# Altium project PCB_Project_sch_layout.PrjPcb (part 2 of 2)

## Sheet Project_Node_Sensors.SchDoc: Principal Node_Sensor Schematic
size A; Date: 10/08/2024; Author: Prudhvi Kondapalli; CompanyName: CU Boulder; DrawnBy: Project_Vega_Team; Engineer: Prudhvi Kondapalli; DocumentNumber: 1; Revision: 1; SheetNumber: 5; SheetTotal: 7
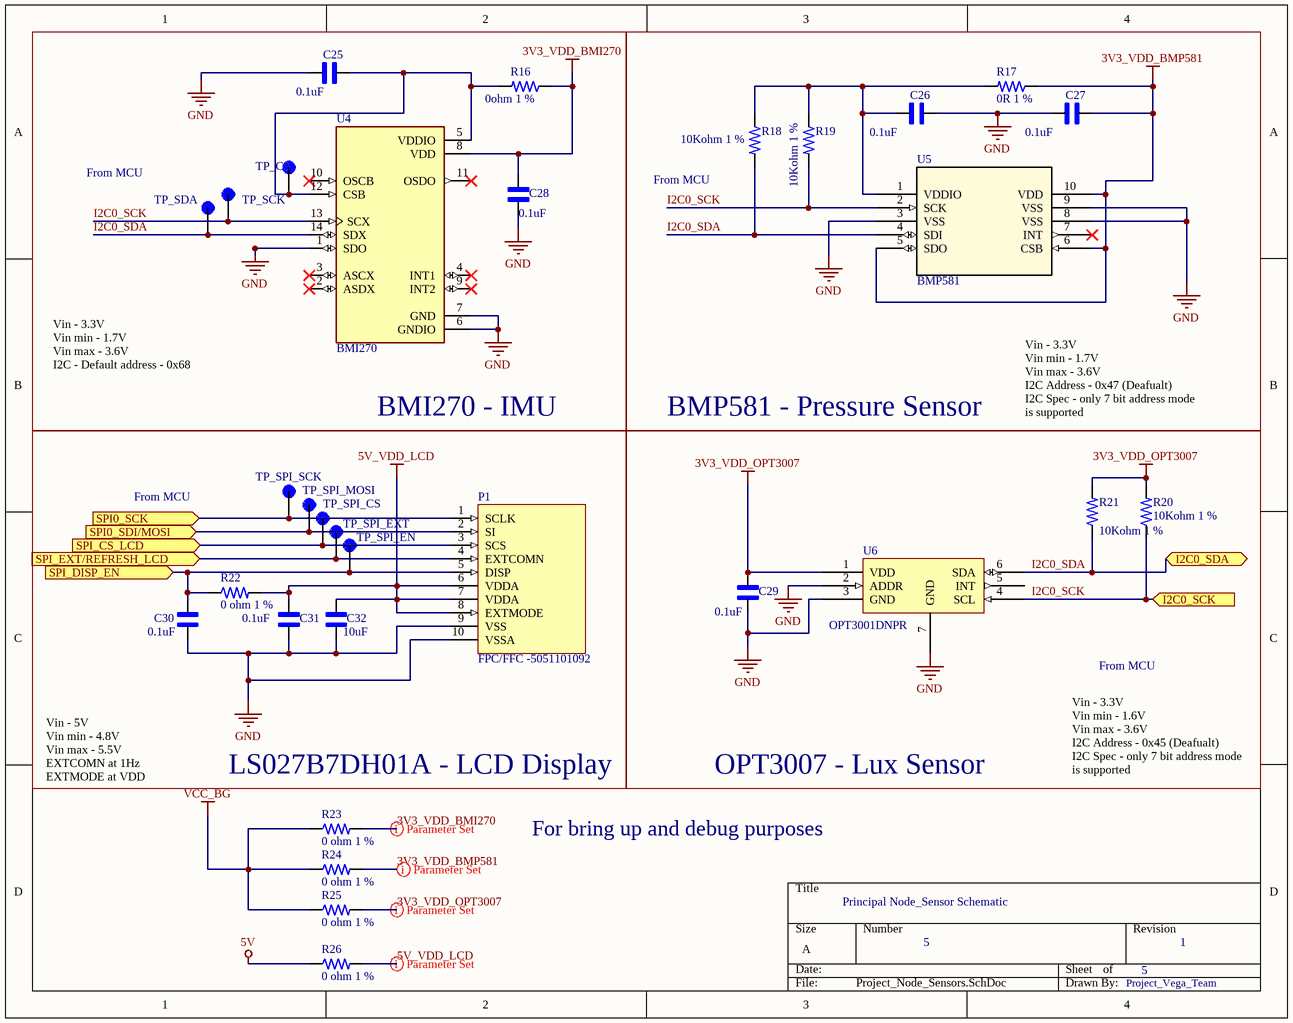
[diagram p4: Project_Node_Sensors.SchDoc]

### Parts
C25  0.1uF  [CAPC1608X90]
C26  0.1uF  [CAPC1608X90]
C27  0.1uF  [CAPC1608X90]
C28  0.1uF  [CAPC1608X90]
C29  0.1uF  [CAPC1608X90]
C30  0.1uF  [CAPC1608X90]
C31  0.1uF  [CAPC1608X90]
C32  10uF  [CAPC1608X90]
P1  FPC/FFC -5051101092  [CON_5051101092_MOL]
R16  0ohm 1 %  [RES_0603_1608X06]
R17  0R 1 %  [RES_0603_1608X06]
R18  10Kohm 1 %  [RES_0603_1608X06]
R19  10Kohm 1 %  [RES_0603_1608X06]
R20  10Kohm 1 %  [RES_0603_1608X06]
R21  10Kohm 1 %  [RES_0603_1608X06]
R22  0 ohm 1 %  [RES_0603_1608X06]
R23  0 ohm 1 %  [RES_0603_1608X06]
R24  0 ohm 1 %  [RES_0603_1608X06]
R25  0 ohm 1 %  [RES_0603_1608X06]
R26  0 ohm 1 %  [RES_0603_1608X06]
TP_CS  Test_point  [1]  (value not drawn)
TP_SCK  Test_point  [1]  (value not drawn)
TP_SDA  Test_point  [1]  (value not drawn)
TP_SPI_CS  Test_point  [1]  (value not drawn)
TP_SPI_EN  Test_point  [1]  (value not drawn)
TP_SPI_EXT  Test_point  [1]  (value not drawn)
TP_SPI_MOSI  Test_point  [1]  (value not drawn)
TP_SPI_SCK  Test_point  [1]  (value not drawn)
U4  BMI270  [XDCR_BMI270]
U5  BMP581  [QFN10_BMP581_BOS-M]
U6  OPT3001DNPR  [OPT3001-SON127P600-8N]

### Blocks framed on the sheet
BMI270 - IMU: C25 C28 R16 TP_CS TP_SCK TP_SDA U4
BMP581 - Pressure Sensor: C26 C27 R17-R19 U5

### Ports
I2C0_SCK (in, see Principal_Node[2C]), I2C0_SDA (bidir, see Principal_Node[2C]), SPI0_SCK (in, see Principal_Node[2D]), SPI0_SDI/MOSI (in, see Principal_Node[2D]), SPI_CS_LCD (in, see Principal_Node[2D]), SPI_DISP_EN (in, see Principal_Node[2C]), SPI_EXT/REFRESH_LCD (in, see Principal_Node[2C])

### Nets
3V3_VDD_BMI270: C28.1 R16.1 R23.2 U4.8(VDD)
3V3_VDD_BMP581: C27.2 R17.1 R24.2 U5.5(SDO) U5.6(CSB) U5.10(VDD)
3V3_VDD_OPT3007: C29.2 R20.2 R21.2 R25.2 U6.1(VDD)
5V: R26.1
5V_VDD_LCD: C31.2 C32.2 P1.6(VDDA) P1.7(VDDA) P1.8(EXTMODE) R22.2 R26.2
GND: C25.1 C26.2 C27.1 C28.2 C29.1 C30.1 C31.1 C32.1 P1.9(VSS) P1.10(VSSA) U4.1(SDO) U4.6(GNDIO) U4.7(GND) U5.3(VSS) U5.8(VSS) U5.9(VSS) U6.2(ADDR) U6.3(GND) U6.7(GND)
VCC_BG: R23.1 R24.1 R25.1
I2C0_SCK: R19.2 R20.1 TP_SCK.TP(I2C_SCK) U4.13(SCX) U5.2(SCK) U6.4(SCL) ; port I2C0_SCK
I2C0_SDA: R18.2 R21.1 TP_SDA.TP(I2C_SDA) U4.14(SDX) U5.4(SDI) U6.6(SDA) ; port I2C0_SDA
NetC25_2: C25.2 R16.2 TP_CS.TP(CS) U4.5(VDDIO) U4.12(CSB)
NetC26_1: C26.1 R17.2 R18.1 R19.1 U5.1(VDDIO)
NetC30_2: C30.2 P1.5(DISP) R22.1 TP_SPI_EN.TP(SPI_EN) ; port SPI_DISP_EN
NetP1_1: P1.1(SCLK) TP_SPI_SCK.TP(SPI_SCK) ; port SPI0_SCK
NetP1_2: P1.2(SI) TP_SPI_MOSI.TP(SPI_MOSI) ; port SPI0_SDI/MOSI
NetP1_3: P1.3(SCS) TP_SPI_CS.TP(SPI_CS) ; port SPI_CS_LCD
NetP1_4: P1.4(EXTCOMN) TP_SPI_EXT.TP(SPI_EXT) ; port SPI_EXT/REFRESH_LCD

Not connected (* = marked no-connect by the designer): U4 2(ASDX)* 3(ASCX)* 4(INT1)* 9(INT2)* 10(OSCB)* 11(OSDO)*; U5 7(INT)*; U6 5(INT)

### Layout directives
rule Width Constraint [Pref Width = 10mil    Min Width = 10mil    Max Width = 10mil]: 3V3_VDD_BMI270, 3V3_VDD_BMP581, 3V3_VDD_OPT3007
rule Width Constraint [Pref Width = 20mil    Min Width = 10mil    Max Width = 20mil]: 5V_VDD_LCD

### Notes on the sheet
- From MCU
- Vin - 3.3V
  Vin min - 1.7V
  Vin max - 3.6V
  I2C - Default address - 0x68
- Vin - 3.3V
  Vin min - 1.7V
  Vin max - 3.6V
  I2C Address - 0x47 (Deafualt)
  I2C Spec - only 7 bit address mode is supported
- Vin - 5V
  Vin min - 4.8V
  Vin max - 5.5V
  EXTCOMN at 1Hz
  EXTMODE at VDD
- (near R23) LS027B7DH01A - LCD Display
- OPT3007 - Lux Sensor
- Vin - 3.3V
  Vin min - 1.6V
  Vin max - 3.6V
  I2C Address - 0x45 (Deafualt)
  I2C Spec - only 7 bit address mode is supported
- For bring up and debug purposes

### Library data of the parts
C25-C32 = CC0603KRX7R9BB104: 0.1 ÂµF Â±10% 50V Ceramic Capacitor X7R 0603 (1608 Metric); MF: Yageo; SnapEDA_Link: https://www.snapeda.com/parts/CC0603KRX7R9BB104/Yageo/view-part/?ref=snap; Package: 0603 Yageo; Value: *; MP: CC0603KRX7R9BB104; Check_prices: https://www.snapeda.com/parts/CC0603KRX7R9BB104/Yageo/view-part/?ref=eda
P1 = 5051101092: Easy-On FFC/FPC Connector, 0.50mm Pitch, FD19 Series, Right-Angle, Bottom Contact, 1.90mm Height, 10 Circuits, Gold over Nickel Plating; Manufacturer: Molex; Manufacturer Part Number: 505110-1092; Actuator Material: Nylon,Glass,Polyamide; Actuator Color: Black; Number of Positions: 10; Voltage Rating: 50V; Gender: Receptacle; Mating Cycles: 25; Supplier: Digikey; Supplier Part Number: WM12366CT-ND; RoHS: Yes; Category: FFC / FPC; Stock: 64732; Pricing: 1=0.73, 10=0.545, 25=0.4884, 50=0.4514, 100=0.4185, 250=0.3808, 500=0.35616, 1000=0.33441, 3000=0.3051, 6000=0.28943, 9000=0.28114, 15000=0.27155, 21000=0.26571, 30000=0.26151 (USD); Mounting Technology: Surface Mount; Pins: 10; Contact Material: Bronze; Contact Plating: Gold; Housing Material: Polymer; Housing Color: Beige; Plating: Gold; Min Operating Temperature: -40°C; Max Operating Temperature: 105°C; Packaging: Cut Tape; Termination: Solder; Number of Rows: 1; Series: Easy-On FD19 505110; Number of Circuits: 10; Number of Contacts: 10; Orientation: Right Angle; Height: 4.15mm; Flammability Rating: UL94 V-0; RoHS Compliant: Yes; Reach SVHC Compliant: Unknown; ComponentLink1URL: http://www.farnell.com/datasheets/2215713.pdf?src-supplier=Farnell; ComponentLink1Description: http://www.farnell.com/datasheets/2215713.pdf?src-supplier=Farnell; ComponentLink2URL: https://media.digikey.com/pdf/Data%20Sheets/Molex%20PDFs/FFC-FPC_Connectors.pdf?src-supplier=Digikey; ComponentLink2Description: https://media.digikey.com/pdf/Data%20Sheets/Molex%20PDFs/FFC-FPC_Connectors.pdf?src-supplier=Digikey; ComponentLink3URL: https://www.mouser.com/ds/2/276/5051101092_FFC_FPC_CONNECTORS-772849.pdf?src-supplier=Mouser; ComponentLink3Description: https://www.mouser.com/ds/2/276/5051101092_FFC_FPC_CONNECTORS-772849.pdf?src-supplier=Mouser; ComponentLink4URL: http://www.alliedelec.com/m/d/498d8ef60ec1840486550b3bb04c7a47.pdf?src-supplier=Allied+Electronics; ComponentLink4Description: http://www.alliedelec.com/m/d/498d8ef60ec1840486550b3bb04c7a47.pdf?src-supplier=Allied+Electronics; ComponentLink5URL: https://www.molex.com/datasheets/rohspdf/5051101092_rohs.pdf?src-supplier=Digikey; ComponentLink5Description: https://www.molex.com/datasheets/rohspdf/5051101092_rohs.pdf?src-supplier=Digikey; ComponentLink6URL: https://datasheet.octopart.com/505110-1092-Molex-datasheet-62088043.pdf?src-supplier=Farnell; ComponentLink6Description: https://datasheet.octopart.com/505110-1092-Molex-datasheet-62088043.pdf?src-supplier=Farnell; ComponentLink7URL: http://www.farnell.com/datasheets/2014276.pdf?src-supplier=Element14; ComponentLink7Description: http://www.farnell.com/datasheets/2014276.pdf?src-supplier=Element14; ComponentLink8URL: http://www.farnell.com/datasheets/2215713.pdf?src-supplier=Element14; ComponentLink8Description: http://www.farnell.com/datasheets/2215713.pdf?src-supplier=Element14; ComponentLink9URL: https://datasheet.octopart.com/505110-1092-Molex-datasheet-77521069.pdf?src-supplier=Element14; ComponentLink9Description: https://datasheet.octopart.com/505110-1092-Molex-datasheet-77521069.pdf?src-supplier=Element14; ComponentLink10URL: http://www.farnell.com/datasheets/2215713.pdf?src-supplier=Newark; ComponentLink10Description: http://www.farnell.com/datasheets/2215713.pdf?src-supplier=Newark
R16-R26 = RC0603FR-07140RL: SMD Chip Resistor, 140 Ohm, ± 1%, 100 mW, 0603 [1608 Metric], Thick Film, General Purpose; Manufacturer: Yageo; Value: 140R; Power Rating: 100mW; Voltage Rating: 50V; Temperature Coefficient: 100ppm/°C; Supplier: Digikey; Supplier Part Number: 311-140HRCT-ND; Manufacturer Part Number: RC0603FR-07140RL; RoHS: Yes; Category: Chip SMD Resistors; Stock: 238807; Pricing: 1=0.1, 10=0.019, 50=0.0112, 100=0.0093, 500=0.00622, 1000=0.00532, 5000=0.00382, 10000=0.00335, 25000=0.00287, 35000=0.00278, 50000=0.00257, 125000=0.00232 (USD); Mounting Technology: Surface Mount; Case/Package: 0603; Case Code (Imperial): 0603; Case Code (Metric): 1608; Min Operating Temperature: -55°C; Max Operating Temperature: 155°C; Tolerance: 1%; Packaging: Tape and Reel; Termination: SMD/SMT; Voltage Rating (DC): 50V; Features: Moisture Resistant; Series: RC; Max Power Dissipation: 100mW; Number of Terminations: 2; Construction: Rectangular; Technology: THICK FILM; Length: 1.6mm; Height: 0.45mm; Depth: 0.8mm; Lead Free: Lead Free; RoHS Compliant: Yes; Military Standard: Not; ComponentLink1URL: https://datasheet.ciiva.com/11808/0900766b80c66297-11808828.pdf?src-supplier=Rs; ComponentLink1Description: https://datasheet.ciiva.com/11808/0900766b80c66297-11808828.pdf?src-supplier=Rs; ComponentLink2URL: https://datasheet.ciiva.com/15189/getdatasheetpartid-329205-15189606.pdf?src-supplier=Verical; ComponentLink2Description: https://datasheet.ciiva.com/15189/getdatasheetpartid-329205-15189606.pdf?src-supplier=Verical
TP_CS TP_SCK TP_SDA TP_SPI_CS TP_SPI_EN TP_SPI_EXT TP_SPI_MOSI TP_SPI_SCK = Test_point: SMT Test Point- Mininature-1000 pc Reels; MP: 5019; MF: Keystone Electronics; Value: *; Availability: In Stock; Purchase-URL: https://pricing.snapeda.com/search/part/5019/?ref=eda; Package: None; Price: None
U4 = BMI270: Accelerometer, Gyroscope, 6 Axis Sensor IÂ²C, SPI Output; MF: Bosch Sensortec; Digi-Key_Part_Number: 828-1091-2-ND; Check_prices: https://www.snapeda.com/parts/BMI270/Bosch+Sensortec/view-part/?ref=eda; MP: BMI270; Package: LGA-14 Bosch Sensortec; SnapEDA_Link: https://www.snapeda.com/parts/BMI270/Bosch+Sensortec/view-part/?ref=snap; Value: *; Purchase-URL: https://pricing.snapeda.com/search/part/BMI270/?ref=eda; Supplier 1: Digikey; Supplier Part Number 1: 828-1091-1-ND
U5 = BMP581: No Description Available; Mfr_Name: Bosch Sensortec; RefDes: RefDes; Type: Type
U6 = OPT3001DNPR: Digital ambient light sensor (ALS) with high-precision human-eye response 6-USON -40 to 85; Manufacturer: Texas Instruments; Interface: I2C; Wavelength: 550nm; Min Supply Voltage: 1.6V; Max Supply Voltage: 3.6V; Clock Frequency: 2.6MHz; Output Type: I2C,Digital; Sensing Method: Optical; Supplier: Digikey; Supplier Part Number: 296-40474-1-ND; Manufacturer Part Number: OPT3001DNPR; RoHS: Yes; Category: Integrated Circuits (ICs); Stock: 51147; Pricing: 1=2.99, 5=2.52, 10=2.342, 25=2.1248, 50=1.9744, 100=1.8347, 500=1.54766, 1000=1.43839 (USD); Mounting Technology: Surface Mount; Pins: 6; Min Operating Temperature: -40°C; Max Operating Temperature: 85°C; Packaging: Tape and Reel; Series: -; Reach SVHC Compliant: No; Lead Free: Lead Free; RoHS Compliant: Yes; ComponentLink1URL: http://www.ti.com/lit/ds/symlink/opt3001.pdf?src-supplier=Digikey; ComponentLink1Description: http://www.ti.com/lit/ds/symlink/opt3001.pdf?src-supplier=Digikey; ComponentLink2URL: http://www.ti.com/general/docs/lit/getliterature.tsp?genericPartNumber=OPT3001&amp;&amp;fileType=pdf&src-supplier=Farnell; ComponentLink2Description: http://www.ti.com/general/docs/lit/getliterature.tsp?genericPartNumber=OPT3001&amp;&amp;fileType=pdf&src-supplier=Farnell; ComponentLink3URL: http://www.ti.com/general/docs/lit/getliterature.tsp?genericPartNumber=OPT3001&&fileType=pdf&src-supplier=Avnet; ComponentLink3Description: http://www.ti.com/general/docs/lit/getliterature.tsp?genericPartNumber=OPT3001&&fileType=pdf&src-supplier=Avnet; ComponentLink4URL: http://www.ti.com/general/docs/lit/getliterature.tsp?genericPartNumber=OPT3001&&fileType=pdf&src-supplier=Element14; ComponentLink4Description: http://www.ti.com/general/docs/lit/getliterature.tsp?genericPartNumber=OPT3001&&fileType=pdf&src-supplier=Element14

## Sheet Client_Node_Block_Diagram.SchDoc: Project_Vega_Client_Node_Block_Diagram
size A4; DrawnBy: Project_Vega_Team; Revision: 1; SheetNumber: 6; SheetTotal: 8
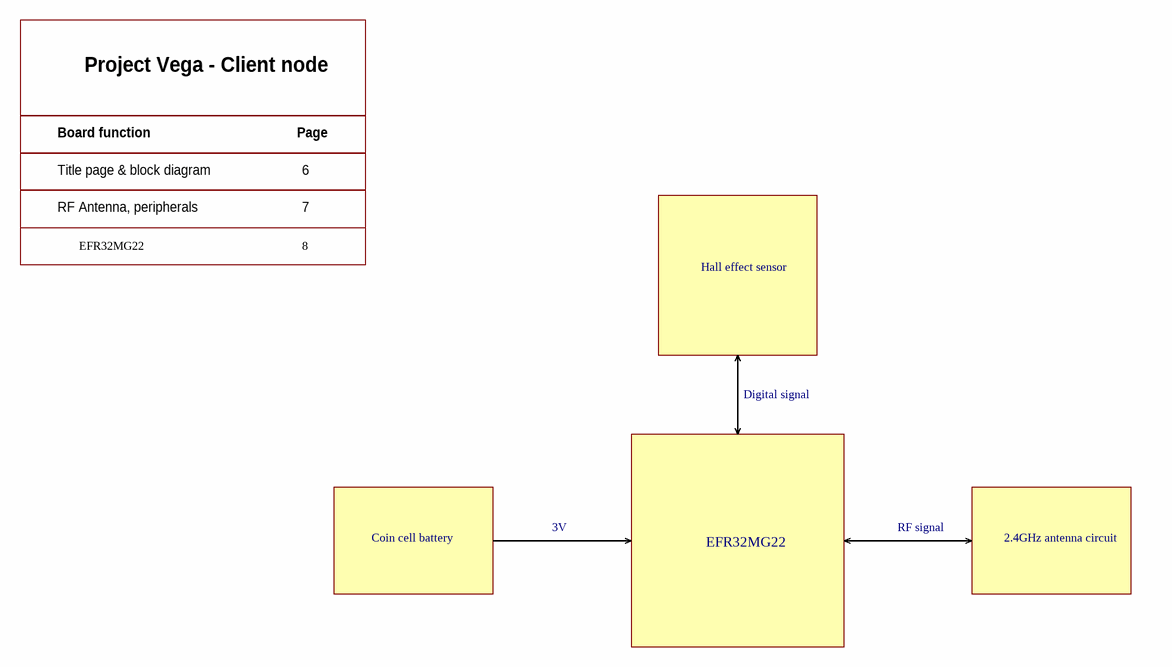
[diagram p5: Client_Node_Block_Diagram.SchDoc]

### Notes on the sheet
- Project Vega - Client node
- Board function
- Page
- Title page & block diagram
- RF Antenna, peripherals
- 6
- 7
- EFR32MG22
- 8
- Hall effect sensor
- Digital signal
- Coin cell battery
- 3V
- RF signal
- 2.4GHz antenna circuit

## Sheet Client_Node_1.SchDoc: Client_Node_1
size A4; DrawnBy: Project_Vega_Team; Revision: 1; SheetNumber: 7; SheetTotal: 8
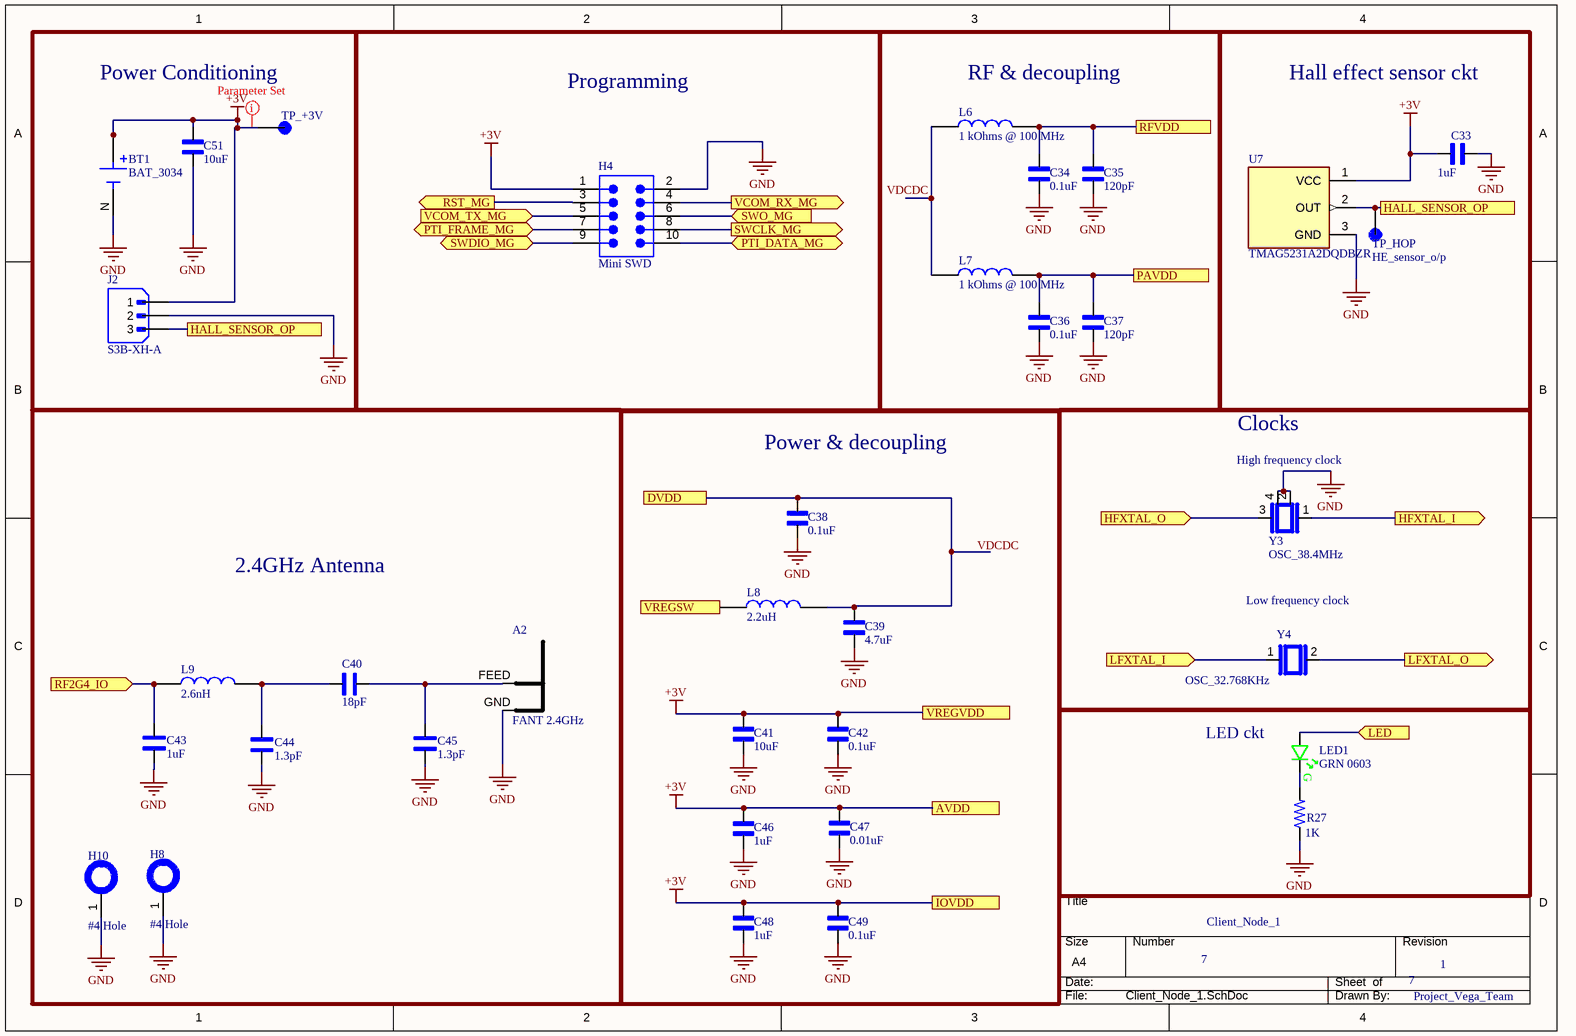
[diagram p6: Client_Node_1.SchDoc]

### Parts
A2  FANT 2.4GHz  [FANT_2P4]
BT1  BAT_3034  [BAT_3034]
C33  1uF  [CAPC1608X90]
C34  0.1uF  [CAPC1608X90]
C35  120pF  [CAPC1608X90]
C36  0.1uF  [CAPC1608X90]
C37  120pF  [CAPC1608X90]
C38  0.1uF  [CAPC1608X90]
C39  4.7uF  [CAPC1608X90]
C40  value 18pF  [0402_Passive_Capacitor]  (hidden comment: 1uF)
C41  10uF  [CAPC1608X90]
C42  0.1uF  [CAPC1608X90]
C43  1uF  [0402_Passive_Capacitor]
C44  1.3pF  [0402_Passive_Capacitor]
C45  1.3pF  [0402_Passive_Capacitor]
C46  1uF  [CAPC1608X90]
C47  0.01uF  [CAPC1608X90]
C48  1uF  [CAPC1608X90]
C49  0.1uF  [CAPC1608X90]
C51  10uF  [CAPC1608X90]
H4  Mini SWD  [FTSH-105-01-XXX-DV-K]
H8  #4 Hole  [HOLE_#4]  (no BOM)
H10  #4 Hole  [HOLE_#4]  (no BOM)
J2  S3B-XH-A  [JST_S3B-XH-A]
L6  1 kOhms @ 100 MHz  [INDC1608X95N]
L7  1 kOhms @ 100 MHz  [INDC1608X95N]
L8  2.2uH  [INDC1608X95N]
L9  2.6nH  [0402_Inductor]
LED1  GRN 0603  [LED_0603_GRN_WL-SMCW]
R27  1K  [RES_0603]
TP_+3V  +5V  [1]  (value not drawn)
TP_HOP  HE_sensor_o/p  [1]
U7  TMAG5231A2DQDBZR  [SOT95P237X112-3N]
Y3  OSC_38.4MHz  [OSC_38.4MHz]
Y4  OSC_32.768KHz  [OSC_32.768KHz]

### Blocks framed on the sheet
Power Conditioning: BT1 C51 J2 TP_+3V
Programming: H4
RF & decoupling: C34-C37 L6 L7
Hall effect sensor ckt: C33 TP_HOP U7
2.4GHz Antenna: A2 C40 C43-C45 H8 H10 L9
Clocks: Y3 Y4
Power & decoupling: C38 C39 C41 C42 C46-C49 L8
LED ckt: LED1 R27

### Ports
AVDD (see Client_Node_2[3B]), DVDD (see Client_Node_2[4A]), HALL_SENSOR_OP (see Client_Node_1[1B], Client_Node_2[2D]), HALL_SENSOR_OP (see Client_Node_1[4A], Client_Node_2[2D]), HFXTAL_I (out, see Client_Node_2[1A]), HFXTAL_O (in, see Client_Node_2[1A]), IOVDD (see Client_Node_2[3B]), LED (in, see Client_Node_2[2D]), LFXTAL_I (in, see Client_Node_2[2D]), LFXTAL_O (out, see Client_Node_2[2D]), PAVDD (see Client_Node_2[1B]), PTI_DATA_MG (bidir, see Client_Node_2[2D]), PTI_FRAME_MG (bidir, see Client_Node_2[2D]), RF2G4_IO (in, see Client_Node_2[2A]), RFVDD (see Client_Node_2[1B]), RST_MG (out, see Client_Node_2[2C], Client_Node_2[3A]), SWCLK_MG (out, see Client_Node_2[2C]), SWDIO_MG (bidir, see Client_Node_2[2C]), SWO_MG (in, see Client_Node_2[2C]), VCOM_RX_MG (out, see Client_Node_2[2C]), VCOM_TX_MG (in, see Client_Node_2[2C]), VREGSW (see Client_Node_2[4A]), VREGVDD (see Client_Node_2[3A])

### Nets
+3V: BT1.P1(POS) BT1.P2(POS) C33.2 C41.1 C42.1 C46.1 C47.1 C48.1 C49.1 C51.1 H4.1 J2.1 TP_+3V.TP U7.1(VCC) ; port VREGVDD, port AVDD, port IOVDD
GND: A2.GND BT1.N(NEG) C33.1 C34.2 C35.2 C36.2 C37.2 C38.2 C39.2 C41.2 C42.2 C43.1 C44.1 C45.2 C46.2 C47.2 C48.2 C49.2 C51.2 H4.2 H8.1 H10.1 J2.2 R27.1 U7.3(GND) Y3.2 Y3.4
VDCDC: L6.1 L7.1
NetA2_FEED: A2.FEED C40.2 C45.1
NetC34_1: C34.1 C35.1 L6.2 ; port RFVDD
NetC36_1: C36.1 C37.1 L7.2 ; port PAVDD
NetC38_1: C38.1 C39.1 L8.2 ; port DVDD
NetC40_1: C40.1 C44.2 L9.2
NetC43_2: C43.2 L9.1 ; port RF2G4_IO
NetH4_3: H4.3 ; port RST_MG
NetH4_4: H4.4 ; port VCOM_RX_MG
NetH4_5: H4.5 ; port VCOM_TX_MG
NetH4_6: H4.6 ; port SWO_MG
NetH4_7: H4.7 ; port PTI_FRAME_MG
NetH4_8: H4.8 ; port SWCLK_MG
NetH4_9: H4.9 ; port SWDIO_MG
NetH4_10: H4.10 ; port PTI_DATA_MG
NetJ2_3: J2.3 TP_HOP.TP U7.2(OUT) ; port HALL_SENSOR_OP
NetL8_1: L8.1 ; port VREGSW
NetLED1_A: LED1.A ; port LED
NetLED1_C: LED1.C R27.2
NetU8_7: Y3.1 ; port HFXTAL_I
NetU8_8: Y3.3 ; port HFXTAL_O
NetU8_31: Y4.1 ; port LFXTAL_I
NetU8_32: Y4.2 ; port LFXTAL_O

### Layout directives
rule Width Constraint [Pref Width = 20mil    Min Width = 6mil    Max Width = 20mil]: +3V

### Notes on the sheet
- (near Y3) High frequency clock
- Low frequency clock
- Labels drawn without touching a wire or pin: VDCDC
- THIS DOCUMENT AND THE DATA DISCLOSED HEREIN OR
- HEREWITH IS THE PROPERTY OF ALTIUM LIMITED AND MAY
- DWG NO:
- REVISION
- REV:
- DESCRIPTION
- DATE
- APPROVED
- BE FREELY DISTRIBUTED IN WHOLE. NO RIGHTS ARE
- RESERVED OR EXPRESS OR IMPLIED WARANTEE GIVEN.
- ENG:
- APPROVALS
- PROJECT
- DSN:
- CHK:
- REFERENCE DOCUMENTS
- PROJECT REVISION:
- TITLE
- DOCUMENT REVISION:
- DESIGN ITEM:
- BOM:
- FAB DWG:
- PCB DWG:
- ASSY DWG:
- SCALE:
- A3
- SIZE
- CAGE CODE
- FILE NAME
- DWG NO.
- SHEET
- OF
- REV
- (in symbol LED_green) G

### Library data of the parts
A2 = FANT_2P4: Inverted F antenna
BT1 = BAT_3034: SMT Holder for 20mm Cell-Tin Nickel Plate; MP: 3034; MF: Keystone Electronics Corp.; SnapEDA_Link: https://www.snapeda.com/parts/3034/Keystone+Electronics/view-part/?ref=snap; Price: None; Check_prices: https://www.snapeda.com/parts/3034/Keystone+Electronics/view-part/?ref=eda; Availability: Not in stock; Value: *; Package: None; Supplier 1: Digikey; Supplier Part Number 1: 36-3034-ND
C33-C39 C41 C42 C46-C49 C51 = CC0603KRX7R9BB104: as C25 on sheet Project_Node_Sensors; SnapEDA_Link: https://www.snapeda.com/parts/CC0603KRX7R9BB104/Yageo/view-part/?ref=snap; Package: 0603 Yageo; Value: *; MP: CC0603KRX7R9BB104; Check_prices: https://www.snapeda.com/parts/CC0603KRX7R9BB104/Yageo/view-part/?ref=eda; Supplier 1: Digikey
  C33 C38 C42 C46 C48 C49: Supplier Part Number 1: 445-12472-1-ND
  C34 C36: Supplier Part Number 1: 445-7456-1-ND
  C35 C37: Supplier Part Number 1: 399-C0603C121J5GACTUCT-ND
  C39: Supplier Part Number 1: 399-C0603C475K9PAC7867CT-ND
  C41 C51: Supplier Part Number 1: 490-7202-1-ND
  C47: Supplier Part Number 1: 311-4054-1-ND
C40 C43-C45 = C_0402: MULTILAYER CERAMIC CAPACITORS MLCC - SMD/SMT 1UF 25V 0402 ROHS; MFR Part #: CL05A105KA5NQNC; Type: Basic; Datasheet: https://datasheet.lcsc.com/szlcsc/Samsung-Electro-Mechanics-CL05A105KA5NQNC_C52923.pdf; LCSC Part#: C52923
  C43-C45: Value: 1uF
H4 = Debug Connector Mini SWD - 0.05": Mini SWD 0.05 Pitch Connector - 10 Pin SMT Box Header | Adafruit Industries 4048; Manufacturer Part Number: 4048; Number of Positions: 10; Manufacturer: Adafruit Industries; RoHS: No; Category: Connectors; Stock 1: 201; Pricing 1: 1=1.95000 (USD); ComponentLink1URL: https://media.digikey.com/pdf/Data%20Sheets/Adafruit%20PDFs/4048_Web.pdf?src-supplier=Digi-Key; ComponentLink1Description: https://media.digikey.com/pdf/Data%20Sheets/Adafruit%20PDFs/4048_Web.pdf?src-supplier=Digi-Key; Supplier 1: Digi-Key; Supplier: Digikey; Supplier Part Number: 1528-2827-ND; Stock: 198; Pricing: 1=1.95 (USD); Mounting Technology: Surface Mount; Contact Shape: Square; Contact Finish - Mating: -; Connector Type: Header; Fastening Type: Pull; Series: -; Contact Type: Male Pin; Number of Rows: 2; Termination: Solder; ComponentLink2URL: https://media.digikey.com/pdf/Data%20Sheets/Adafruit%20PDFs/4048_Web.pdf?src-supplier=Digikey; ComponentLink2Description: https://media.digikey.com/pdf/Data%20Sheets/Adafruit%20PDFs/4048_Web.pdf?src-supplier=Digikey
H8 H10 = HOLE_#4
J2 = S3B-XH-A: Connector Header Through Hole 3 position 0.098 (2.50mm); MF: JST Sales; MP: B3B-XH-A(LF)(SN); SnapEDA_Link: https://www.snapeda.com/parts/B3B-XH-A(LF)(SN)/JST+Sales+America+Inc./view-part/?ref=snap; Package: None; Value: *; Check_prices: https://www.snapeda.com/parts/B3B-XH-A(LF)(SN)/JST+Sales+America+Inc./view-part/?ref=eda; Supplier 1: Digikey; Supplier Part Number 1: 455-S3B-XH-A-ND
L6-L8 = LQM18DN100M70L: Inductor with Inductance 10uH Tol.+/-20% Package 0603 (1608); MF: Murata Electronics; MP: LQM18DN100M70L; Price: None; SnapEDA_Link: https://www.snapeda.com/parts/LQM18DN100M70L/Murata/view-part/4834755/?ref=snap; Package: 0603 Murata; Availability: Unavailable; Value: *
L9 = IND_0402: Inductor Package 0603; MP: LQM18DN100M70L; MF: Murata Electronics; Price: None; SnapEDA_Link: https://www.snapeda.com/parts/LQM18DN100M70L/Murata/view-part/4834755/?ref=snap; Package: 0603 Murata; Availability: Unavailable; Value: *
LED1 = LED_green: LED, 0603, GREEN, 430MCD, 520NM; Manufacturer: Wurth Electronics; Manufacturer Part Number: 150060GS75000; Dynamic Catalog: 0603 Rectangle with Flat Top Chip LEDs; 3D Model: SMCW_0603.igs / SMCW_0603.stp / SMCW_0603.wrl; Wavelength - Peak: 515nm; Voltage - Forward (Vf) (Typ): 3.2V; Current - Test: 20mA; Viewing Angle: 140°; Lens Type: Clear; Lens Style/Size: Rectangle with Flat Top, 1.1mm x 0.7mm; Other Names: 732-4971-2; Supplier 1: Digi-Key; Stock 1: 34964; Pricing 1: 1=0.14, 50=0.129, 100=0.11, 500=0.095 (USD); Standard Package: 4,000; Category: Optoelectronics; Family: LED Indication - Discrete; Series: WL-SMCW; Packaging: Tape & Reel (TR); Color: Green; Wavelength - Dominant: 520nm; Millicandela Rating: 430mcd; Package / Case: 0603 (1608 Metric); Size / Dimension: 1.60mm L x 0.80mm W; Height: 0.70mm; Mounting Type: Surface Mount; Online Catalog: 0603 Rectangle with Flat Top Chip LEDs; ComponentLink1URL: https://katalog.we-online.de/led/datasheet/150060GS75000.pdf?src-supplier=Digi-Key; ComponentLink1Description: https://katalog.we-online.de/led/datasheet/150060GS75000.pdf?src-supplier=Digi-Key; ComponentLink2URL: http://www.produktinfo.conrad.com/datenblaetter/750000-774999/759427-da-01-en-CHIPLED_0603_W_KL_GRUEN_150060GS75000.pdf?src-supplier=Conrad; ComponentLink2Description: http://www.produktinfo.conrad.com/datenblaetter/750000-774999/759427-da-01-en-CHIPLED_0603_W_KL_GRUEN_150060GS75000.pdf?src-supplier=Conrad; Supplier Part Number 1: 732-4971-1-ND
R27 = RES_0603: Thick film general purpose resistor 0603; MP: RC0603JR-070RL; Availability: Unavailable; Package: None; Value: *; Price: None
TP_+3V TP_HOP = Test_point: as TP_CS on sheet Project_Node_Sensors; Value: *; Availability: In Stock; Purchase-URL: https://pricing.snapeda.com/search/part/5019/?ref=eda; Package: None; Price: None
U7 = TMAG5231A2DQDBZR: Low-power, low-voltage (1.65 V to 5.5 V) Hall-effect switch 3-SOT-23 -40 to 125; Manufacturer: Texas Instruments; MF: {'manufacturer': u'Texas Instruments'}; Package: None; Price: None; Value: *; MP: TMAG5231A2DQDBZR; Availability: Unavailable; Supplier 1: Digikey; Supplier Part Number 1: 296-TMAG5231A2DQDBZRCT-ND; Supplier: Digikey; Supplier Part Number: 296-TMAG5231A2DQDBZRCT-ND; Manufacturer Part Number: TMAG5231A2DQDBZR; RoHS: No; Stock: 1920; Pricing: 1=0.4, 5=0.342, 10=0.317, 25=0.2872, 50=0.267, 100=0.248, 500=0.20916, 1000=0.19436 (USD)
Y3 = OSC_38.4MHz: 38.4 MHz ±10ppm Crystal 10pF 40 Ohms 4-SMD, No Lead; MF: {'manufacturer': u'Murata Electronics'}; MP: XRCGB38M400F2P00R0; Package: None; Price: None; Value: *; Availability: Unavailable; Supplier 1: Digikey; Supplier Part Number 1: 4606-TZ3398BCT-ND
Y4 = OSC_32.768KHz: Tuning Fork Crystal 32.768kHz in 1.2 x 2.0mm package; MF: Micro Crystal; MP: CM8V-T1A-32.768KHZ-7PF-20PPM-TA-QC; Package: SMD-2 Micro Crystal; Price: None; Value: *; SnapEDA_Link: https://www.snapeda.com/parts/CM8V-T1A-32.768KHZ-7PF-20PPM-TA-QC/Micro+Crystal/view-part/?ref=snap; Availability: Not in stock; Check_prices: https://www.snapeda.com/parts/CM8V-T1A-32.768KHZ-7PF-20PPM-TA-QC/Micro+Crystal/view-part/?ref=eda; Supplier 1: Digikey; Supplier Part Number 1: 2195-CM8V-T1A-32.768KHZ-7PF-20PPM-TA-QCCT-ND

## Sheet Client_Node_2.SchDoc: Client_Node_2
size A4; DrawnBy: Project_Vega_Team; Revision: 1; SheetNumber: 8; SheetTotal: 8
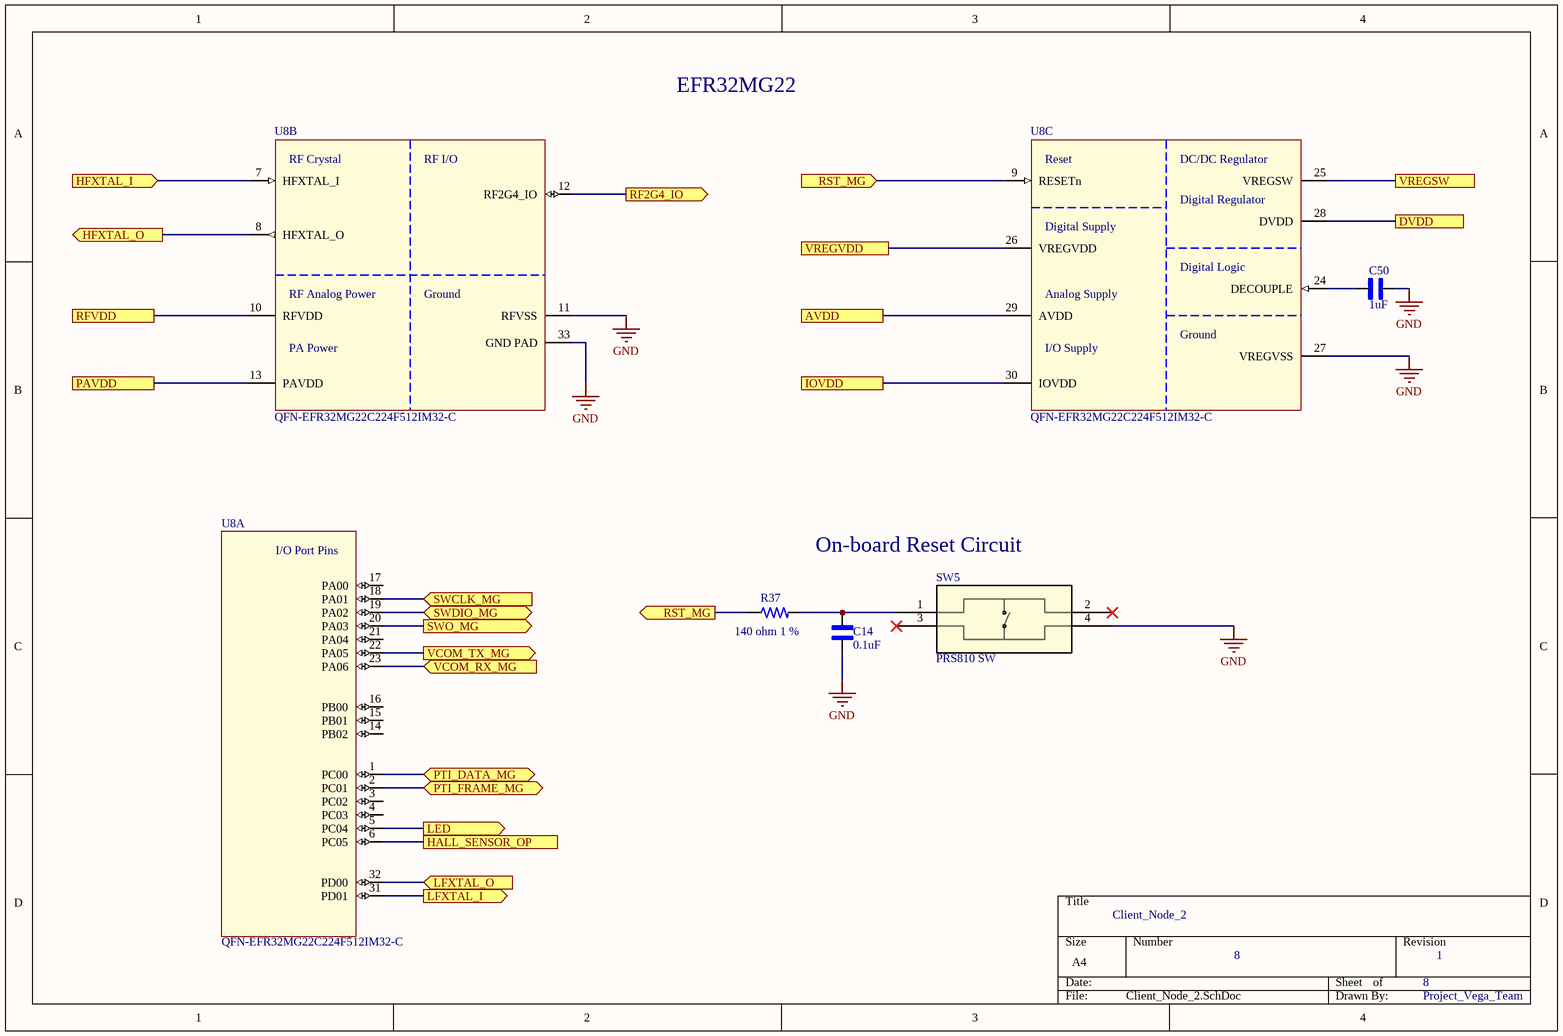
[diagram p7: Client_Node_2.SchDoc]

### Parts
C14  0.1uF  [CAPC1608X90]
C50  1uF  [CAPC1608X90]
R37  140 ohm 1 %  [RES_0603_1608X06]
SW5  PRS810 SW  [PTS810_CNK]
U8  QFN-EFR32MG22C224F512IM32-C  [QFN32-EFR32xG2xIM32-BR]  (parts A,B,C of 3)

### Ports
AVDD (see Client_Node_1[3D]), DVDD (see Client_Node_1[2B]), HALL_SENSOR_OP (see Client_Node_1[1B], Client_Node_1[4A]), HFXTAL_I (in, see Client_Node_1[4C]), HFXTAL_O (out, see Client_Node_1[3C]), IOVDD (see Client_Node_1[3D]), LED (out, see Client_Node_1[4C]), LFXTAL_I (out, see Client_Node_1[3C]), LFXTAL_O (in, see Client_Node_1[4C]), PAVDD (see Client_Node_1[3B]), PTI_DATA_MG (bidir, see Client_Node_1[2A]), PTI_FRAME_MG (bidir, see Client_Node_1[2A]), RF2G4_IO (out, see Client_Node_1[1C]), RFVDD (see Client_Node_1[3A]), RST_MG (in, see Client_Node_1[2A], Client_Node_2[2C]), RST_MG (out, see Client_Node_1[2A], Client_Node_2[3A]), SWCLK_MG (in, see Client_Node_1[2A]), SWDIO_MG (bidir, see Client_Node_1[2A]), SWO_MG (out, see Client_Node_1[2A]), VCOM_RX_MG (in, see Client_Node_1[2A]), VCOM_TX_MG (out, see Client_Node_1[2A]), VREGSW (see Client_Node_1[2C]), VREGVDD (see Client_Node_1[3C])

### Nets
+3V: U8.26(VREGVDD) U8.29(AVDD) U8.30(IOVDD) ; port VREGVDD, port AVDD, port IOVDD
GND: C14.2 C50.2 SW5.4 U8.11(RFVSS) U8.27(VREGVSS) U8.33(GND_PAD)
NetC14_1: C14.1 R37.2 SW5.1
NetC34_1: U8.10(RFVDD) ; port RFVDD
NetC36_1: U8.13(PAVDD) ; port PAVDD
NetC38_1: U8.28(DVDD) ; port DVDD
NetC43_2: U8.12(RF2G4_IO) ; port RF2G4_IO
NetC50_1: C50.1 U8.24(DECOUPLE)
NetH4_3: R37.1 U8.9(RESETn) ; port RST_MG
NetH4_4: U8.23(PA06) ; port VCOM_RX_MG
NetH4_5: U8.22(PA05) ; port VCOM_TX_MG
NetH4_6: U8.20(PA03) ; port SWO_MG
NetH4_7: U8.2(PC01) ; port PTI_FRAME_MG
NetH4_8: U8.18(PA01) ; port SWCLK_MG
NetH4_9: U8.19(PA02) ; port SWDIO_MG
NetH4_10: U8.1(PC00) ; port PTI_DATA_MG
NetJ2_3: U8.6(PC05) ; port HALL_SENSOR_OP
NetL8_1: U8.25(VREGSW) ; port VREGSW
NetLED1_A: U8.5(PC04) ; port LED
NetU8_7: U8.7(HFXTAL_I) ; port HFXTAL_I
NetU8_8: U8.8(HFXTAL_O) ; port HFXTAL_O
NetU8_31: U8.31(PD01) ; port LFXTAL_I
NetU8_32: U8.32(PD00) ; port LFXTAL_O

Not connected (* = marked no-connect by the designer): SW5 2* 3*; U8 3(PC02) 4(PC03) 14(PB02) 15(PB01) 16(PB00) 17(PA00) 21(PA04)

### Notes on the sheet
- EFR32MG22
- On-board Reset Circuit
- (in symbol EFR32MG22C224F512IM32-C, part A) I/O Port Pins
- (in symbol EFR32MG22C224F512IM32-C, part B) RF Crystal; RF I/O; RF Analog Power; Ground; PA Power
- (in symbol EFR32MG22C224F512IM32-C, part C) Reset; DC/DC Regulator; Digital Regulator; Digital Supply; Digital Logic; Analog Supply; Ground; I/O Supply

### Library data of the parts
C14 C50 = CC0603KRX7R9BB104: as C25 on sheet Project_Node_Sensors; SnapEDA_Link: https://www.snapeda.com/parts/CC0603KRX7R9BB104/Yageo/view-part/?ref=snap; Package: 0603 Yageo; Value: *; MP: CC0603KRX7R9BB104; Check_prices: https://www.snapeda.com/parts/CC0603KRX7R9BB104/Yageo/view-part/?ref=eda
  C50: Supplier 1: Digikey; Supplier Part Number 1: 445-12472-1-ND
R37 = RC0603FR-07140RL: as R16 on sheet Project_Node_Sensors; Supplier: Digikey; Supplier Part Number: 311-140HRCT-ND; Manufacturer Part Number: RC0603FR-07140RL; RoHS: Yes; Category: Chip SMD Resistors; Stock: 238807; Pricing: 1=0.1, 10=0.019, 50=0.0112, 100=0.0093, 500=0.00622, 1000=0.00532, 5000=0.00382, 10000=0.00335, 25000=0.00287, 35000=0.00278, 50000=0.00257, 125000=0.00232 (USD); Mounting Technology: Surface Mount; Case/Package: 0603; Case Code (Imperial): 0603; Case Code (Metric): 1608; Min Operating Temperature: -55°C; Max Operating Temperature: 155°C; Tolerance: 1%; Packaging: Tape and Reel; Termination: SMD/SMT; Voltage Rating (DC): 50V; Features: Moisture Resistant; Series: RC; Max Power Dissipation: 100mW; Number of Terminations: 2; Construction: Rectangular; Technology: THICK FILM; Length: 1.6mm; Height: 0.45mm; Depth: 0.8mm; Lead Free: Lead Free; RoHS Compliant: Yes; Military Standard: Not; ComponentLink1URL: https://datasheet.ciiva.com/11808/0900766b80c66297-11808828.pdf?src-supplier=Rs; ComponentLink1Description: https://datasheet.ciiva.com/11808/0900766b80c66297-11808828.pdf?src-supplier=Rs; ComponentLink2URL: https://datasheet.ciiva.com/15189/getdatasheetpartid-329205-15189606.pdf?src-supplier=Verical; ComponentLink2Description: https://datasheet.ciiva.com/15189/getdatasheetpartid-329205-15189606.pdf?src-supplier=Verical
SW5 = PTS810SJM250SMTRLFS: Switch Tactile N.O. SPST Button J-Bend 0.05A 16V 150000Cycles 1.569N SMD T/R; Manufacturer: ITT C&K; Actuator Color: Grey; Operating Force: 160gf; Current Rating: 50mA; Illumination Type: Non-Illuminated; Switch Travel: 0.15mm; Switch Function: Off-Mom; Number of Positions: 2; Actuator Type: Standard; Contact Resistance: 500mR; Supplier: Digikey; Supplier Part Number: CKN10502CT-ND; Manufacturer Part Number: PTS810SJM250SMTRLFS; RoHS: Yes; Stock: 130228; Pricing: 1=0.49, 10=0.474, 25=0.4568, 100=0.3954, 250=0.36028, 500=0.3339, 1000=0.29876, 2900=0.28294, 5800=0.26185, 14500=0.24428 (USD); Mounting Technology: Surface Mount; Case/Package: SMD/SMT; Pins: 4; Mechanical Life: 150000Cycles; Color: Black; Contact Plating: Silver; Min Operating Temperature: -40°C; Max Operating Temperature: 85°C; Throw Configuration: SPST; Packaging: Tape and Reel; Voltage Rating (DC): 16V; Package Quantity: 2900; Series: PTS810; Termination: J-Bend; Max Current Rating: 50mA; Orientation: Straight; Contact Current Rating: 50mA; Length: 3.2mm; Depth: 4.6mm; RoHS Compliant: Yes; Lead Free: Lead Free; ComponentLink1URL: https://datasheet.ciiva.com/24082/pts810-4mar13-248115-24082262.pdf?src-supplier=Mouser; ComponentLink1Description: https://datasheet.ciiva.com/24082/pts810-4mar13-248115-24082262.pdf?src-supplier=Mouser; ComponentLink2URL: https://datasheet.ciiva.com/18514/pts810-4mar13-18514058.pdf?src-supplier=Digikey; ComponentLink2Description: https://datasheet.ciiva.com/18514/pts810-4mar13-18514058.pdf?src-supplier=Digikey; ComponentLink3URL: https://datasheet.ciiva.com/18514/pts810-4mar13-18514059.pdf?src-supplier=Digikey; ComponentLink3Description: https://datasheet.ciiva.com/18514/pts810-4mar13-18514059.pdf?src-supplier=Digikey; ComponentLink4URL: https://datasheet.ciiva.com/18514/pts810-4mar13-18514060.pdf?src-supplier=Digikey; ComponentLink4Description: https://datasheet.ciiva.com/18514/pts810-4mar13-18514060.pdf?src-supplier=Digikey
U8 = EFR32MG22C224F512IM32-C: Mighty Gecko, QFN32, 2.4G, 6dB, Mesh, 512kB, 32kB(RAM), 18 GPIO; Manufacturer: Silicon Labs; Supplier: Digikey; Supplier Part Number: 336-EFR32MG22C224F512IM32-C-ND; Manufacturer Part Number: EFR32MG22C224F512IM32-C; RoHS: No; Category: RF Receivers, Transceivers; Stock: 1733; Pricing: 1=3, 10=2.68, 25=2.4124, 80=2.19775, 230=1.98339, 490=1.88751 (USD); Series: -; RoHS Compliant: Yes; ComponentLink1URL: https://media.digikey.com/pdf/Data%20Sheets/Silicon%20Laboratories%20PDFs/EFR32MG22C224F512_DS.pdf?src-supplier=Digikey; ComponentLink1Description: https://media.digikey.com/pdf/Data%20Sheets/Silicon%20Laboratories%20PDFs/EFR32MG22C224F512_DS.pdf?src-supplier=Digikey

## Nets that join several sheets
5V: Input_power (C1.2 U1.1 U1.2), Project_Node_Sensors (R26.1)
+3V: Client_Node_1 (14 pins), Client_Node_2 (U8.26 U8.29 U8.30)
GND: Input_power (26 pins), Power_Sheet (22 pins), Principal_Node (22 pins), Project_Node_Sensors (19 pins), Client_Node_1 (27 pins), Client_Node_2 (6 pins)
V_IN: Input_power (Q1.2 Q2.3 TP_VIN.TP), Power_Sheet (5 pins)
VCC_BG: Input_power (6 pins), Power_Sheet (6 pins), Principal_Node (11 pins), Project_Node_Sensors (R23.1 R24.1 R25.1)
I2C0_SCK: Principal_Node (U3.17), Project_Node_Sensors (6 pins)
I2C0_SDA: Principal_Node (U3.21), Project_Node_Sensors (6 pins)
NetC30_2: Principal_Node (R15.2), Project_Node_Sensors (C30.2 P1.5 R22.1 TP_SPI_EN.TP)
NetC34_1: Client_Node_1 (C34.1 C35.1 L6.2), Client_Node_2 (U8.10)
NetC36_1: Client_Node_1 (C36.1 C37.1 L7.2), Client_Node_2 (U8.13)
NetC38_1: Client_Node_1 (C38.1 C39.1 L8.2), Client_Node_2 (U8.28)
NetC43_2: Client_Node_1 (C43.2 L9.1), Client_Node_2 (U8.12)
NetH4_3: Client_Node_1 (H4.3), Client_Node_2 (R37.1 U8.9)
NetH4_4: Client_Node_1 (H4.4), Client_Node_2 (U8.23)
NetH4_5: Client_Node_1 (H4.5), Client_Node_2 (U8.22)
NetH4_6: Client_Node_1 (H4.6), Client_Node_2 (U8.20)
NetH4_7: Client_Node_1 (H4.7), Client_Node_2 (U8.2)
NetH4_8: Client_Node_1 (H4.8), Client_Node_2 (U8.18)
NetH4_9: Client_Node_1 (H4.9), Client_Node_2 (U8.19)
NetH4_10: Client_Node_1 (H4.10), Client_Node_2 (U8.1)
NetJ2_3: Client_Node_1 (J2.3 TP_HOP.TP U7.2), Client_Node_2 (U8.6)
NetJ3_3: Input_power (J3.3), Principal_Node (R34.1)
NetJ4_3: Input_power (J4.3), Principal_Node (R35.2)
NetL8_1: Client_Node_1 (L8.1), Client_Node_2 (U8.25)
NetLED1_A: Client_Node_1 (LED1.A), Client_Node_2 (U8.5)
NetP1_1: Principal_Node (U3.1), Project_Node_Sensors (P1.1 TP_SPI_SCK.TP)
NetP1_2: Principal_Node (U3.4), Project_Node_Sensors (P1.2 TP_SPI_MOSI.TP)
NetP1_3: Principal_Node (U3.2), Project_Node_Sensors (P1.3 TP_SPI_CS.TP)
NetP1_4: Principal_Node (U3.16), Project_Node_Sensors (P1.4 TP_SPI_EXT.TP)
NetR33_2: Input_power (SW3.1), Principal_Node (R33.2)
NetR36_2: Input_power (SW2.1), Principal_Node (R36.2)
NetSW4_1: Input_power (SW4.1), Principal_Node (U3.28)
NetU1_4: Input_power (U1.4), Principal_Node (U3.3)
NetU8_7: Client_Node_1 (Y3.1), Client_Node_2 (U8.7)
NetU8_8: Client_Node_1 (Y3.3), Client_Node_2 (U8.8)
NetU8_31: Client_Node_1 (Y4.1), Client_Node_2 (U8.31)
NetU8_32: Client_Node_1 (Y4.2), Client_Node_2 (U8.32)